# EAGLE schematic 8x8r1 (EAGLE 7.3.0)
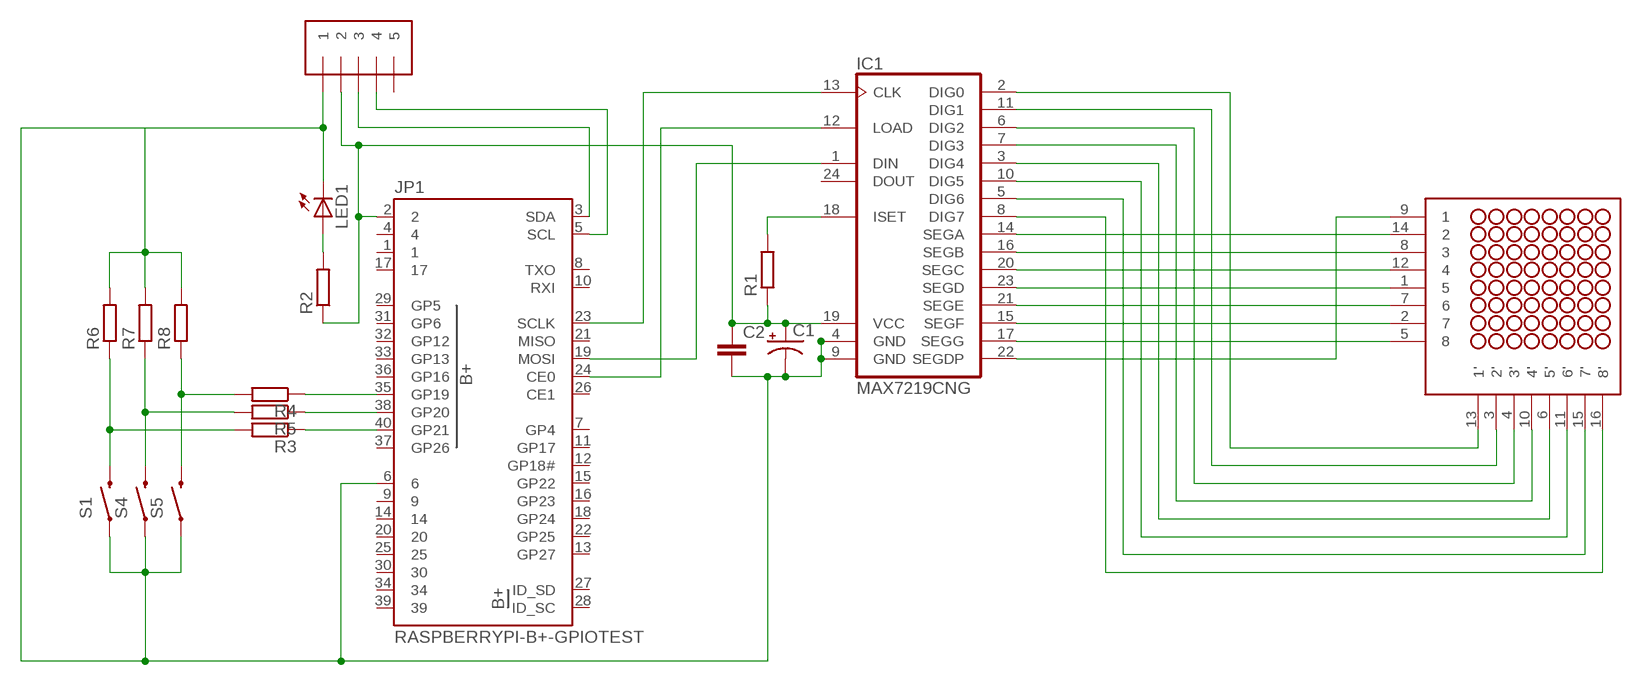
[diagram p0: schematic, sheet 1]

## Parts
C1  CPOL-USE2.5-7  [E2,5-7]
C2  C-EU025-024X044  [C025-024X044]
IC1  MAX7219CNG  [DIL24-3]
J1  1X5  [1X05-3.5MM]
JP1  RASPBERRYPI-B+-GPIOTEST  [2X20-SHROUDED]
LED1  LED3MM  [LED3MM]
R1  R-EU_0204/7  [0204/7]
R2  R-EU_0204/7  [0204/7]
R3  R-EU_0204/7  [0204/7]
R4  R-EU_0204/7  [0204/7]
R5  R-EU_0204/7  [0204/7]
R6  R-EU_0204/7  [0204/7]
R7  R-EU_0204/7  [0204/7]
R8  R-EU_0204/7  [0204/7]
S1  SPARKFUN-ELECTROMECHANICAL_SWITCH-MOMENTARY-2PTH  [SPARKFUN-ELECTROMECHANICAL_TACTILE-PTH]
S4  SPARKFUN-ELECTROMECHANICAL_SWITCH-MOMENTARY-2PTH  [SPARKFUN-ELECTROMECHANICAL_TACTILE-PTH]
S5  SPARKFUN-ELECTROMECHANICAL_SWITCH-MOMENTARY-2PTH  [SPARKFUN-ELECTROMECHANICAL_TACTILE-PTH]
U$1  NFM-12881BG-11  [NFM-12881BG-11]

## Nets
N$1: IC1.2(DIG0) U$1.13(1')
N$2: IC1.11(DIG1) U$1.3(2')
N$3: IC1.6(DIG2) U$1.4(3')
N$4: IC1.7(DIG3) U$1.10(4')
N$5: IC1.3(DIG4) U$1.6(5')
N$6: IC1.10(DIG5) U$1.11(6')
N$7: IC1.5(DIG6) U$1.15(7')
N$8: IC1.8(DIG7) U$1.16(8')
N$9: IC1.17(SEGG) U$1.5
N$10: IC1.15(SEGF) U$1.2
N$11: IC1.21(SEGE) U$1.7
N$12: IC1.23(SEGD) U$1.1
N$13: IC1.20(SEGC) U$1.12
N$14: IC1.16(SEGB) U$1.8
N$15: IC1.14(SEGA) U$1.14
N$16: IC1.22(SEGDP) U$1.9
N$18: C1.+ C2.1 IC1.19(VCC) J1.2 JP1.2 R1.1 R2.1
N$19: IC1.18(ISET) R1.2
N$20: IC1.12(LOAD) JP1.24(CE0)
N$21: IC1.1(DIN) JP1.19(MOSI)
N$22: IC1.13(CLK) JP1.23(SCLK)
N$23: LED1.A R2.2
N$24: JP1.35(GP19) R4.1
N$25: J1.3 JP1.3(SDA)
N$26: J1.4 JP1.5(SCL)
N$27: JP1.38(GP20) R5.1
N$28: JP1.40(GP21) R3.1
N$29: R4.2 R8.1 S5.3
N$30: R5.2 R7.1 S4.3
N$31: R3.2 R6.1 S1.3
N$32: C1.- C2.2 IC1.4(GND) IC1.9(GND) J1.1 JP1.6 LED1.K(C) R6.2 R7.2 R8.2 S1.1 S4.1 S5.1
Unconnected: IC1.24(DOUT) J1.5 JP1.7(GP4) JP1.8(TXO) JP1.10(RXI) JP1.11(GP17) JP1.12(GP18#) JP1.13(GP27) JP1.15(GP22) JP1.16(GP23) JP1.18(GP24) JP1.21(MISO) JP1.22(GP25) JP1.26(CE1) JP1.27(ID_SD) JP1.28(ID_SC) JP1.29(GP5) JP1.31(GP6) JP1.32(GP12) JP1.33(GP13) JP1.36(GP16) JP1.37(GP26)

## Power pins joined to a net without a drawn wire
1: JP1.1
4: JP1.4
9: JP1.9
14: JP1.14
17: JP1.17
20: JP1.20
25: JP1.25
30: JP1.30
34: JP1.34
39: JP1.39

## Library data of the parts
C1 = resistor:CPOL-US: POLARIZED CAPACITOR, American symbol
C2 = resistor:C-EU: CAPACITOR, European symbol
IC1 = maxim:MAX7219CNG: LED DISPLAY DRIVER; MF: MAXIM; MPN: MAX7219CNG; OC_FARNELL: 1523914; OC_NEWARK: 34C4018
J1 = adafruit:1X5
JP1 = SparkFun-Boards:RASPBERRYPI-B+-GPIO: Raspberry Pi B+ GPIO Header 2x20 pin connector
LED1 = adafruit:LED: LED OSRAM: - CHIPLED LG R971, LG N971, LY N971, LG Q971, LY Q971, LO R971, LY R971 LH N974, LH R974 LS Q976, LO Q976, LY Q976 LO Q996 - Hyper CHIPLED LW Q18S LB Q993, LB Q99A, LB R99A - SideLED LS A670, LO A670, LY A670, LG A670, LP A670 LB A673, LV A673, LT A673, LW A673 LH A674 LY A675 LS A676, LA A676, LO A676, LY A676, LW A676 LS A679, LY A679, LG A679 - Hyper Micro SIDELED® LS Y876, LA Y876, LO Y876, LY Y876 LT Y87S - SmartLED LW L88C, LW L88S LB L89C, LB L89S, LG L890 LS L89K, LO L89K, LY L89K LS L896, LA L896, LO L896, LY L896 - TOPLED LS T670, LO T670, LY T670, LG T670, LP T670 LSG T670, LSP T670, LSY T670, LOP T670, LYG T670 LG T671, LOG T671, LSG T671 LB T673, LV T673, LT T673, LW T673 LH T674 LS T676, LA T676, LO T676, LY T676, LB T676, LH T676, LSB T676, LW T676 LB T67C, LV T67C, LT T67C, LS T67K, LO T67K, LY T67K, LW E67C LS E67B, LA E67B, LO E67B, LY E67B, LB E67C, LV E67C, LT E67C LW T67C LS T679, LY T679, LG T679 LS T770, LO T770, LY T770, LG T770, LP T770 LB T773, LV T773, LT T773, LW T773 LH T774 LS E675, LA E675, LY E675, LS T675 LS T776, LA T776, LO T776, LY T776, LB T776 LHGB T686 LT T68C, LB T68C - Hyper Mini TOPLED® LB M676 - Mini TOPLED Santana® LG M470 LS M47K, LO M47K, LY M47K Source: http://www.osram.convergy.de/
R1-R8 = resistor:R-EU_: RESISTOR, European symbol
S1 S4 S5 = MuxclockR10:SPARKFUN-ELECTROMECHANICAL_SWITCH-MOMENTARY-2: Various NO switches- pushbuttons, reed, etc
U$1 = eagle-library-edeca.net-v5:NFM-12881BG-11: Futurlec 8x8 LED Matrix